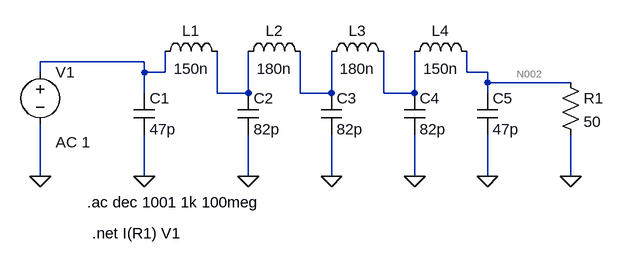
[diagram p0: schematic 70mhz-lpf.asc]
70mhz-lpf.asc, the LTspice schematic file:
Version 4
SHEET 1 880 680
WIRE -80 80 -240 80
WIRE -240 96 -240 80
WIRE -80 96 -80 80
WIRE -48 96 -48 64
WIRE -48 96 -80 96
WIRE 416 96 416 64
WIRE 448 96 416 96
WIRE 448 112 448 96
WIRE 576 112 448 112
WIRE -80 128 -80 96
WIRE 32 128 32 64
WIRE 80 128 80 64
WIRE 80 128 32 128
WIRE 160 128 160 64
WIRE 208 128 208 64
WIRE 208 128 160 128
WIRE 288 128 288 64
WIRE 336 128 336 64
WIRE 336 128 288 128
WIRE 448 128 448 112
WIRE -240 256 -240 176
WIRE -80 256 -80 192
WIRE 80 256 80 192
WIRE 208 256 208 192
WIRE 336 256 336 192
WIRE 448 256 448 192
WIRE 576 256 576 192
FLAG -240 256 0
FLAG -80 256 0
FLAG 80 256 0
FLAG 208 256 0
FLAG 336 256 0
FLAG 448 256 0
FLAG 576 256 0
SYMBOL ind -64 80 R270
WINDOW 0 32 56 VTop 2
WINDOW 3 5 56 VBottom 2
SYMATTR InstName L1
SYMATTR Value 150n
SYMBOL ind 64 80 R270
WINDOW 0 32 56 VTop 2
WINDOW 3 5 56 VBottom 2
SYMATTR InstName L2
SYMATTR Value 180n
SYMBOL ind 192 80 R270
WINDOW 0 32 56 VTop 2
WINDOW 3 5 56 VBottom 2
SYMATTR InstName L3
SYMATTR Value 180n
SYMBOL ind 320 80 R270
WINDOW 0 32 56 VTop 2
WINDOW 3 5 56 VBottom 2
SYMATTR InstName L4
SYMATTR Value 150n
SYMBOL cap -96 128 R0
SYMATTR InstName C1
SYMATTR Value 47p
SYMBOL cap 64 128 R0
SYMATTR InstName C2
SYMATTR Value 82p
SYMBOL cap 192 128 R0
SYMATTR InstName C3
SYMATTR Value 82p
SYMBOL cap 320 128 R0
SYMATTR InstName C4
SYMATTR Value 82p
SYMBOL cap 432 128 R0
SYMATTR InstName C5
SYMATTR Value 47p
SYMBOL voltage -240 80 R0
WINDOW 123 24 124 Left 2
WINDOW 39 24 152 Left 2
SYMATTR Value2 AC 1
SYMATTR InstName V1
SYMATTR Value ""
SYMBOL res 560 96 R0
SYMATTR InstName R1
SYMATTR Value 50
TEXT -168 296 Left 2 !.ac dec 1001 1k 100meg
TEXT -160 344 Left 2 !.net I(R1) V1

The netlist it stands for:
* 70mhz-lpf.asc
L1 N001 N003 150n
L2 N003 N004 180n
L3 N004 N005 180n
L4 N005 N002 150n
C1 N001 0 47p
C2 N003 0 82p
C3 N004 0 82p
C4 N005 0 82p
C5 N002 0 47p
V1 N001 0 AC 1
R1 N002 0 50
.ac dec 1001 1k 100meg
.net I(R1) V1
.backanno
.end

* Results of the author's LTspice run, read from the files saved beside the schematic
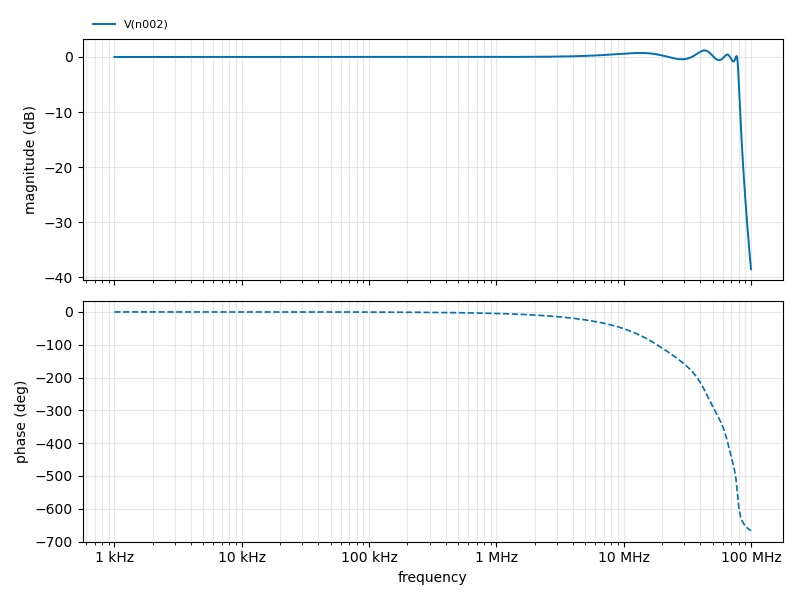
[diagram p1: AC Analysis of 70mhz-lpf.asc, plotted from the saved traces]
* AC Analysis, 1 run:
*   V(n002): -0.00 dB at 1 kHz, -38.57 dB at 100 MHz, peak 1.20 dB at 43.09 MHz, 3 dB below the peak at 79.06 MHz